# EAGLE design BBqP1 (EAGLE 7.2.0)
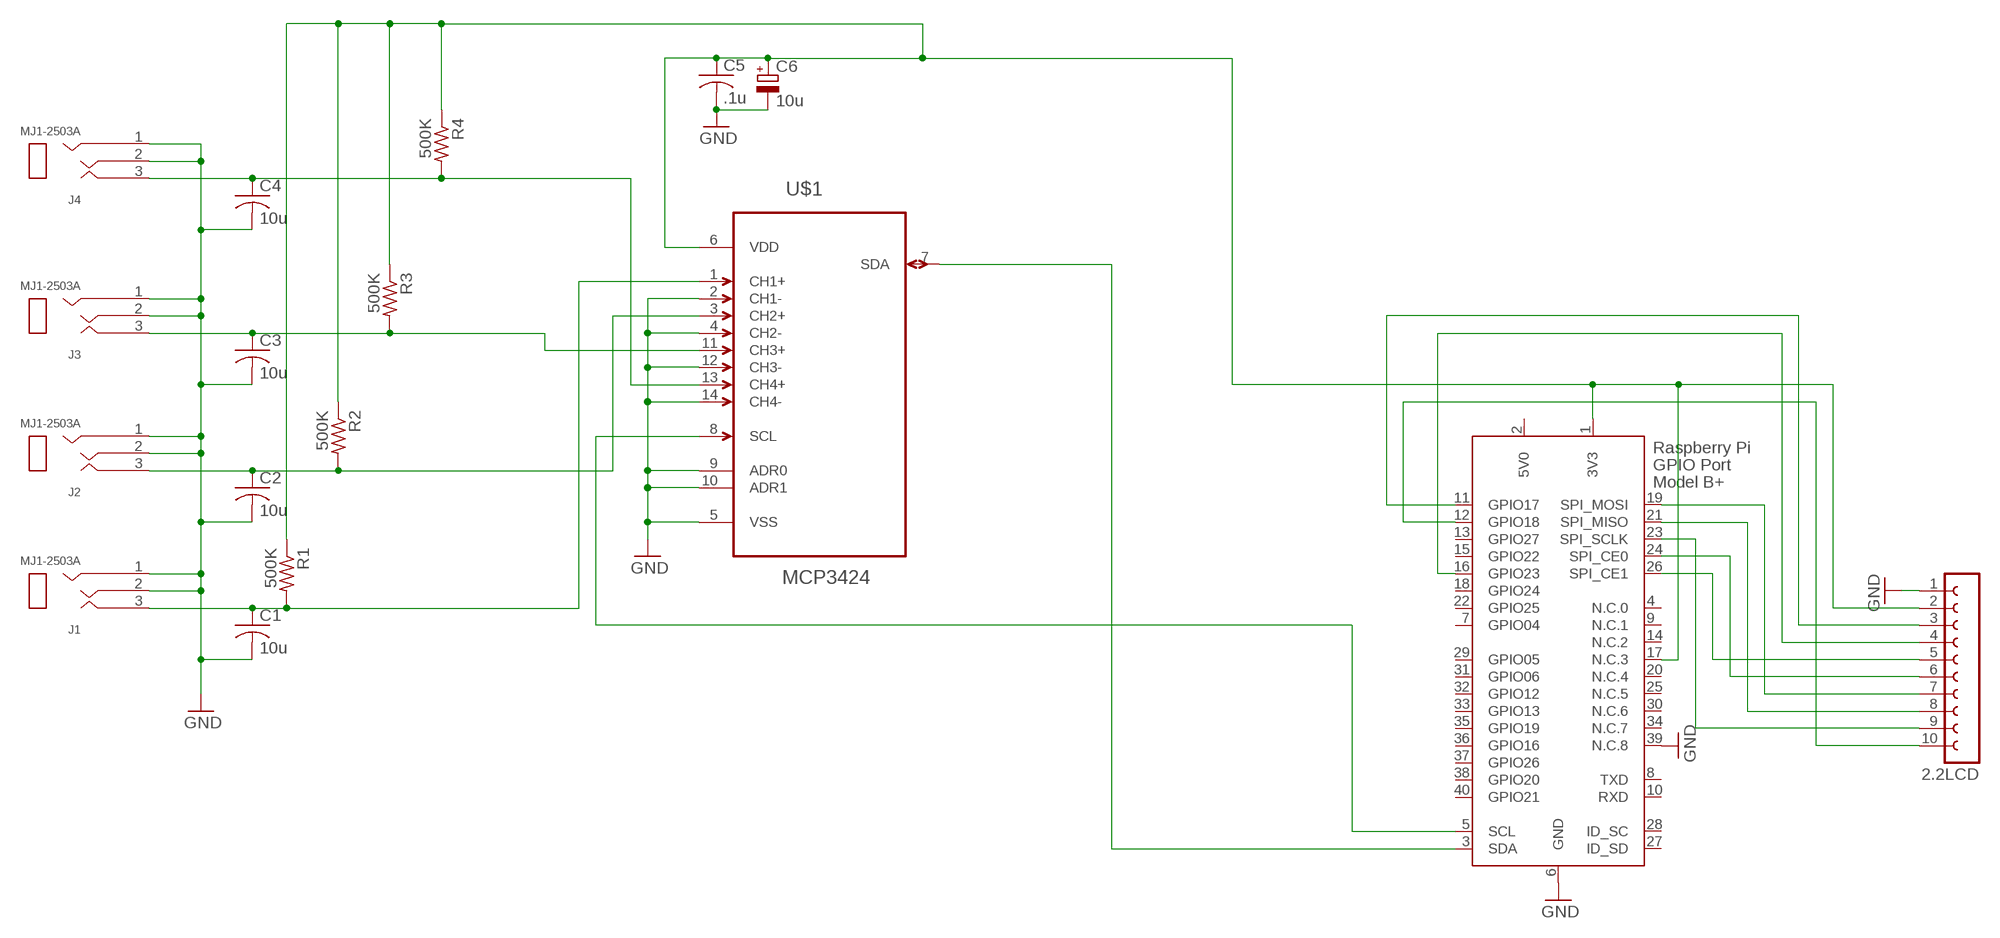
[diagram p0: schematic, sheet 1]

## Parts
2.2LCD  FE10-1  [FE10]
C1  10u  C-USC1206  [C1206]
C2  10u  C-USC1206  [C1206]
C3  10u  C-USC1206  [C1206]
C4  10u  C-USC1206  [C1206]
C5  .1u  C-USC1206  [C1206]
C6  10u  CPOL-EUSMCC  [SMC_C]
J1  MJ1-2503A  [MJ1-2503A]
J2  MJ1-2503A  [MJ1-2503A]
J3  MJ1-2503A  [MJ1-2503A]
J4  MJ1-2503A  [MJ1-2503A]
R1  500K  R-US_R1206  [R1206]
R2  500K  R-US_R1206  [R1206]
R3  500K  R-US_R1206  [R1206]
R4  500K  R-US_R1206  [R1206]
U$1  MCP3424  MCP3424-E/SL  [SOIC127P600X175-14N]
X1  RASPI_BOARD_B+_H  [RASPI_BOARD_B+HAT]

## Nets
3V3: 2.2LCD.2 C5.1 C6.+ R1.1 R2.1 R3.1 R4.1 U$1.6(VDD) X1.1(3V3) X1.17(N.C.3)
GND: 2.2LCD.1 C1.2 C2.2 C3.2 C4.2 C5.2 C6.- J1.1 J1.2 J2.1 J2.2 J3.1 J3.2 J4.1 J4.2 U$1.2(CH1-) U$1.4(CH2-) U$1.5(VSS) U$1.9(ADR0) U$1.10(ADR1) U$1.12(CH3-) U$1.14(CH4-) X1.6(GND) X1.39(N.C.8)
N$1: C4.1 J4.3 R4.2 U$1.13(CH4+)
N$2: 2.2LCD.10 X1.12(GPIO18)
N$3: C3.1 J3.3 R3.2 U$1.11(CH3+)
N$4: C2.1 J2.3 R2.2 U$1.3(CH2+)
N$5: C1.1 J1.3 R1.2 U$1.1(CH1+)
N$6: 2.2LCD.4 X1.16(GPIO23)
N$7: 2.2LCD.8 X1.21(SPI_MISO)
N$8: U$1.8(SCL) X1.5(SCL)
N$9: 2.2LCD.7 X1.19(SPI_MOSI)
N$10: 2.2LCD.6 X1.24(SPI_CE0)
N$11: U$1.7(SDA) X1.3(SDA)
N$12: 2.2LCD.5 X1.26(SPI_CE1)
N$13: 2.2LCD.9 X1.23(SPI_SCLK)
N$14: 2.2LCD.3 X1.11(GPIO17)
Unconnected: X1.4(N.C.0) X1.7(GPIO04) X1.8(TXD) X1.9(N.C.1) X1.10(RXD) X1.13(GPIO27) X1.14(N.C.2) X1.15(GPIO22) X1.18(GPIO24) X1.20(N.C.4) X1.22(GPIO25) X1.25(N.C.5) X1.27(ID_SD) X1.28(ID_SC) X1.29(GPIO05) X1.30(N.C.6) X1.31(GPIO06) X1.32(GPIO12) X1.33(GPIO13) X1.34(N.C.7) X1.35(GPIO19) X1.36(GPIO16) X1.37(GPIO26) X1.38(GPIO20) X1.40(GPIO21)

## Power pins joined to a net without a drawn wire
5V0: X1.2(5V0)

## Library data of the parts
2.2LCD = con-lsta:FE10-1: FEMALE HEADER; OC_FARNELL: unknown; OC_NEWARK: unknown
C1-C4 = adafruit:C-US: CAPACITOR, American symbol; MPN: C1206C106M4RACTU; OC_NEWARK: 07X1011
C5 = adafruit:C-US: CAPACITOR, American symbol; MPN: C1206C104K5RACAUTO; OC_NEWARK: 86T2669
C6 = rcl:CPOL-EU: POLARIZED CAPACITOR, European symbol; MF: KEMET; MPN: T491C106M016AT; OC_NEWARK: 12J9584
J1-J4 = con-cuistack:MJ1-2503A: Mono Audio Jack, 2.5 MM
R1-R4 = adafruit:R-US_: RESISTOR, American symbol; MF: VISHAY/DALE; MPN: CRCW1206510KFKEA; OC_NEWARK: 53K2481
U$1 = mcp3424:MCP3424-E/SL: Analog-to-Digital Converter; MPN: MCP3424-E/SL; OC_FARNELL: 1630424; OC_NEWARK: 54M4871; PACKAGE: SOIC-14; SUPPLIER: Microchip
X1 = raspberrypi_bastelstube_v13:RASPI_BOARD_B+: Raspberry Pi GPIO connector with markings for the outer dimensions of the Raspberry Pi board model B+ with different sets of drill holes or mounting pads

## Board
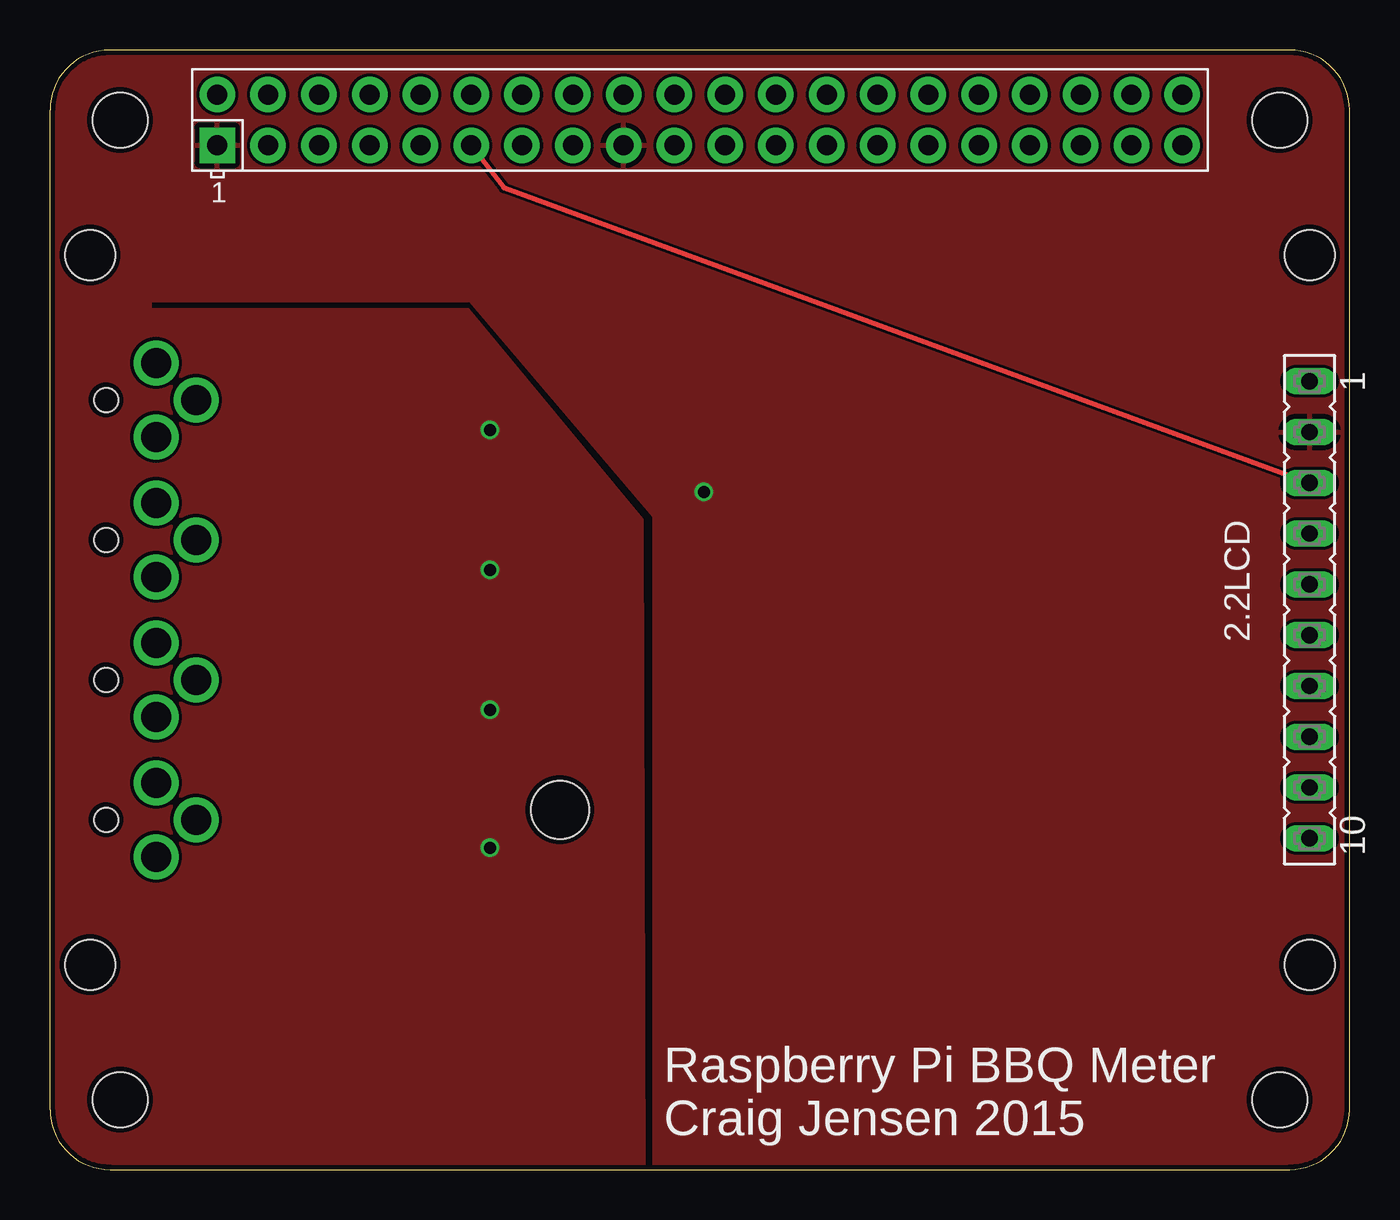
[diagram p1: board, top side]
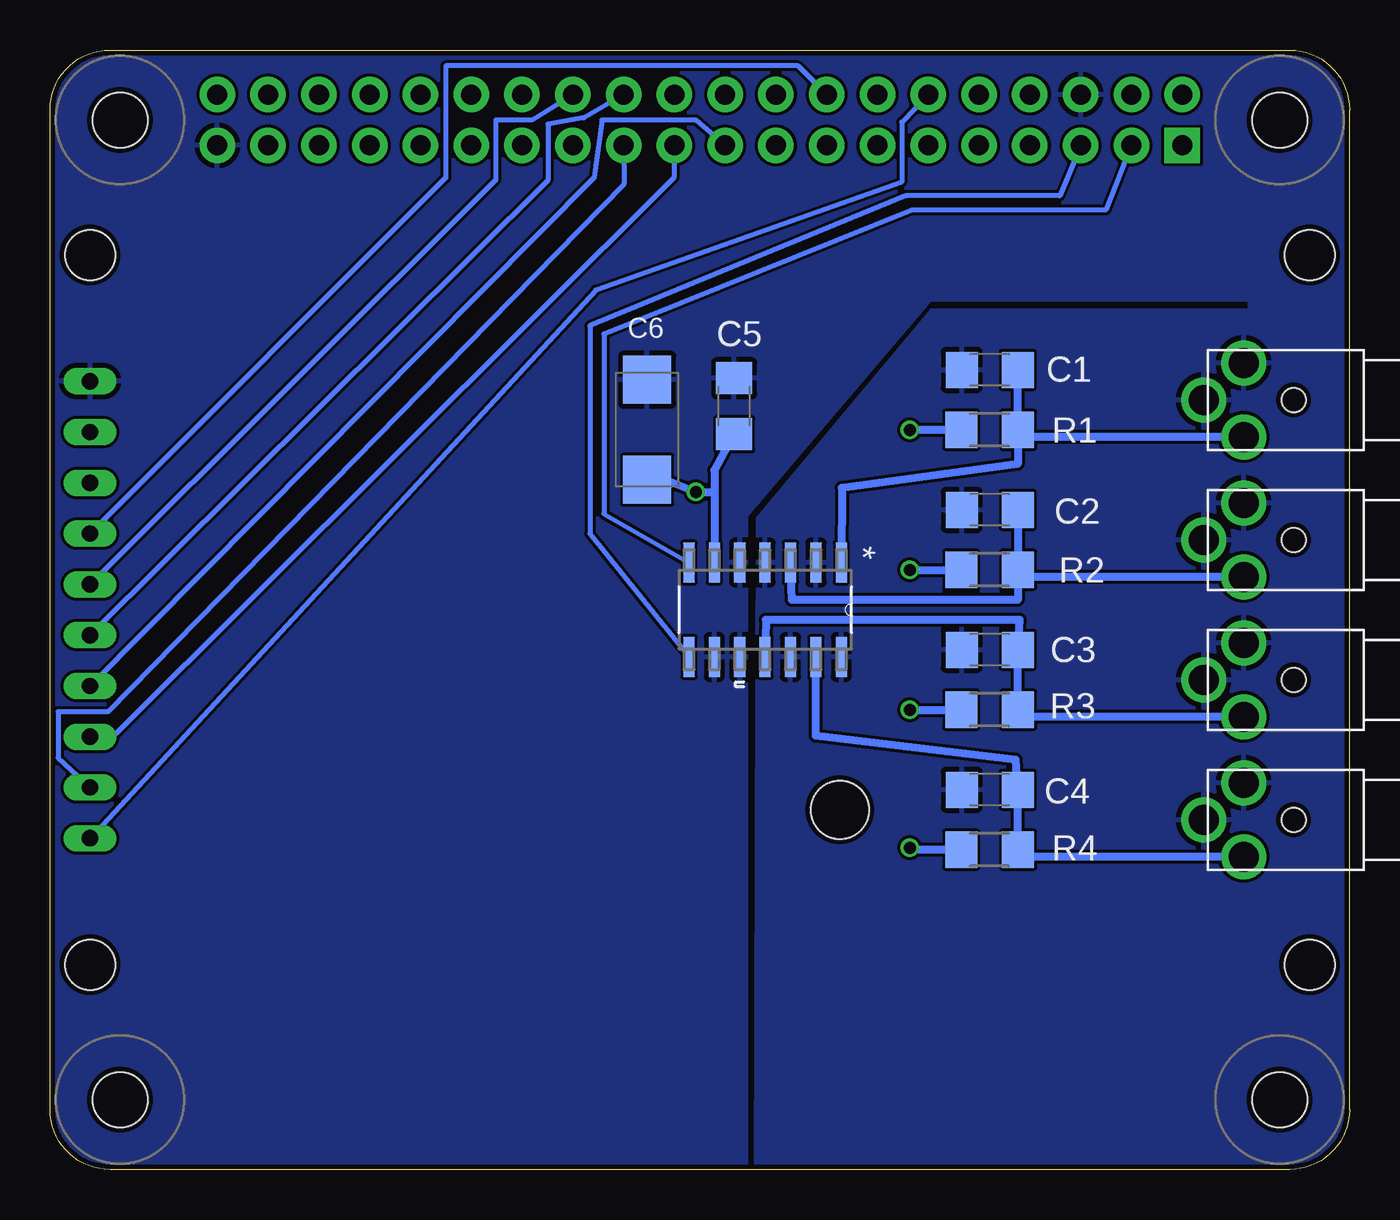
[diagram p2: board, bottom side, seen from below]

Size 65 x 56 mm. Coordinates in mm from the lower left corner, seen from the top.
Copper layers (1*16): Top 0.035mm / dielectric 1.5mm / Bottom 0.035mm
Design rules "SeeedStudio_2layer_DRU_no_angle_20140221": minimum track width 6mil, minimum drill 12mil, track to track 6mil, track to pad 6mil, pad to pad 6mil, via to via 6mil, smd to smd 0mil, copper to edge 10mil, drill to drill 10mil, minimum pad ring 10mil, minimum via ring 6mil, stop-mask expansion 2mil, vias tented up to drill 100mil, thermal gap 10mil
Holes 2.5 mm at 2,10.25 63,10.25 63,45.75 2,45.75
Holes 2.9 mm at 25.5,18

### Footprints (pad centres in the part's own frame; a part is rotated, then mirrored left to right if it is on the bottom)
FE10 = drill 0.813 long: 1 -11.43,0; 2 -8.89,0; 3 -6.35,0; 4 -3.81,0; 5 -1.27,0; 6 1.27,0; 7 3.81,0; 8 6.35,0; 9 8.89,0; 10 11.43,0
C1206 = smd 1.6 x 1.8: 1 -1.4,0; 2 1.4,0
SMC_C = smd 2.4 x 2.4: + -2.5,0; - 2.5,0
MJ1-2503A = drill 1.5: 1 8,0; 2 6,-1.85; 3 6,1.85 | hole 1.2: 3.5,0
R1206 = smd 1.6 x 1.803: 1 -1.422,0; 2 1.422,0
SOIC127P600X175-14N = smd 1.981 x 0.559: 1 -2.362,3.81; 2 -2.362,2.54; 3 -2.362,1.27; 4 -2.362,0; 5 -2.362,-1.27; 6 -2.362,-2.54; 7 -2.362,-3.81; 8 2.362,-3.81; 9 2.362,-2.54; 10 2.362,-1.27; 11 2.362,0; 12 2.362,1.27; 13 2.362,2.54; 14 2.362,3.81
RASPI_BOARD_B+HAT = drill 1 pad 1.778 square: 1 8.37,51.23 | drill 1 pad 1.778: 2 8.37,53.77; 3 10.91,51.23; 4 10.91,53.77; 5 13.45,51.23; 6 13.45,53.77; 7 15.99,51.23; 8 15.99,53.77; 9 18.53,51.23; 10 18.53,53.77; 11 21.07,51.23; 12 21.07,53.77; 13 23.61,51.23; 14 23.61,53.77; 15 26.15,51.23; 16 26.15,53.77; 17 28.69,51.23; 18 28.69,53.77; 19 31.23,51.23; 20 31.23,53.77; 21 33.77,51.23; 22 33.77,53.77; 23 36.31,51.23; 24 36.31,53.77; 25 38.85,51.23; 26 38.85,53.77; 27 41.39,51.23; 28 41.39,53.77; 29 43.93,51.23; 30 43.93,53.77; 31 46.47,51.23; 32 46.47,53.77; 33 49.01,51.23; 34 49.01,53.77; 35 51.55,51.23; 36 51.55,53.77; 37 54.09,51.23; 38 54.09,53.77; 39 56.63,51.23; 40 56.63,53.77 | hole 2.75: 3.5,3.5; 3.5,52.5; 61.5,3.5; 61.5,52.5

### Placement (x,y rotation side)
2.2LCD  63,28 270 top
C1  18,40 180 bottom
C2  18,33 180 bottom
C3  18,26 180 bottom
C4  18,19 180 bottom
C5  30.78,38.18 90 bottom
C6  35.13,37.01 90 bottom
J1  -0.7,38.5 180 bottom
J2  -0.7,31.5 180 bottom
J3  -0.7,24.5 180 bottom
J4  -0.7,17.5 180 bottom
R1  18,37 0 bottom
R2  18,30 0 bottom
R3  18,23 0 bottom
R4  18,16 0 bottom
U$1  29.23,28 270 bottom
X1  0,0 0 top

### Tracks (layer width: path | path; a pad name or v marks a point on that pad's centre or on a via)
3V3  (via drill 0.6)
  Bottom 0.406: R1.1 v22,37 | C6.+ 35.33,34.98 v32.7,33.9 31.77,33.9 | C5.1 31.77,34.98 31.77,33.9 | 31.77,33.9 U$1.6 | v22,23 R3.1 | v22,30 R2.1 | R4.1 22,16 v22,16.1
  pour Top: 5,43.5 21,43.5 30.2,32.7 30.2,-0.6 65.5,-0.6 65.5,56.7 -1,56.7 -1,-0.6 29.7,-0.6 29.6,32.5 20.9,43 5,43
GND
  pour Bottom: 5,43.5 21,43.5 30.2,32.7 30.2,-0.6 66,-0.6 66,56.7 -0.7,56.7 -0.7,-0.6 29.7,-0.6 29.6,32.6 20.9,43 5,43
N$1
  Bottom 0.406: U$1.13 26.7,21.7 16.7,20.5 C4.1 R4.2 16.58,15.65 J4.3
N$2
  Bottom 0.254: X1.12 22.4,52.4 22.4,49.4 37.7,44 2.2LCD.10
N$3
  Bottom 0.406: U$1.11 29.2,27.5 16.5,27.5 C3.1 R3.2 16.58,22.65 J3.3
N$4
  Bottom 0.406: C2.1 R2.2 16.59,29.51 | 16.59,29.51 16.6,28.5 27.9,28.5 U$1.3 | J2.3 16.59,29.65 16.59,29.51
N$5
  Bottom 0.406: R1.2 C1.1 | R1.2 16.6,35.3 25.4,34.1 U$1.1 | J1.3 16.58,36.65 R1.2
N$6
  Bottom 0.254: X1.16 27.6,55.2 45.2,55.2 45.2,49.6 2.2LCD.4
N$7
  Bottom 0.254: X1.21 33.8,49.6 61.7,21.8 2.2LCD.8
N$8
  Bottom 0.254: X1.5 14.5,48.7 22.2,48.7 38,42.2 38,31.8 U$1.8
N$9
  Bottom 0.254: X1.19 32.7,52.5 37.4,52.5 37.8,49.6 2.2LCD.7
N$10
  Bottom 0.254: X1.24 38.3,52.6 40.1,52.3 40.1,49.5 2.2LCD.6
N$11
  Bottom 0.254: X1.3 12.2,48 21.9,48 37.3,41.8 37.3,32.8 U$1.7
N$12
  Bottom 0.254: X1.26 40.9,52.5 42.7,52.5 42.7,49.5 2.2LCD.5
N$13
  Bottom 0.254: X1.23 36.3,49.3 62.1,22.9 64.6,22.9 64.6,20.6 2.2LCD.9
N$14
  Top 0.254: X1.11 22.7,49.1 2.2LCD.3

### Text on the board
tNames: Raspberry Pi BBQ Meter / Craig Jensen 2015